# Altium schematic sheet Sheet1_TRP.SchDoc
size A4; SheetNumber: 1; SheetTotal: 1
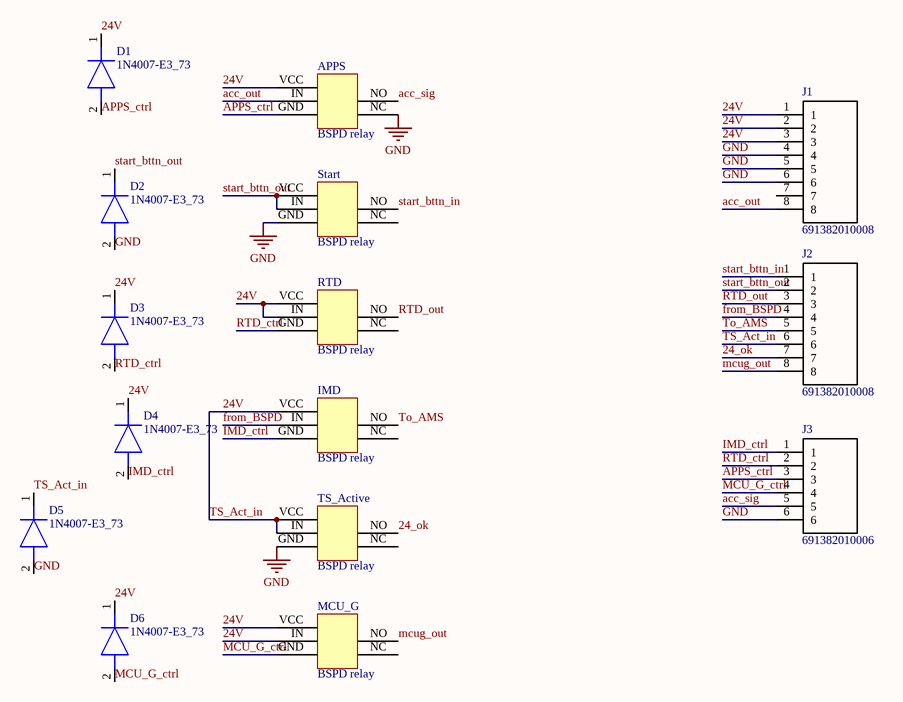
[diagram p0: Sheet1_TRP.SchDoc]

## Parts
APPS  BSPD relay  [relay]
D1  1N4007-E3_73  [DIOAD1405W86L465D235]
D2  1N4007-E3_73  [DIOAD1405W86L465D235]
D3  1N4007-E3_73  [DIOAD1405W86L465D235]
D4  1N4007-E3_73  [DIOAD1405W86L465D235]
D5  1N4007-E3_73  [DIOAD1405W86L465D235]
D6  1N4007-E3_73  [DIOAD1405W86L465D235]
IMD  BSPD relay  [relay]
J1  691382010008  [SHDRRA8W80P0X250_1X8_2200X1010X830P]
J2  691382010008  [SHDRRA8W80P0X250_1X8_2200X1010X830P]
J3  691382010006  [SHDRRA6W100P0X250_1X6_1700X1010X830P]
MCU_G  BSPD relay  [relay]
RTD  BSPD relay  [relay]
Start  BSPD relay  [relay]
TS_Active  BSPD relay  [relay]

## Nets
GND: APPS.NC D2.2(A) D5.2(A) J1.4 J1.5 J1.6 J3.6 Start.GND TS_Active.GND
24_ok: J2.7 TS_Active.NO
24V: APPS.VCC D1.1(K) D3.1(K) D4.1(K) D5.1(K) D6.1(K) IMD.VCC J1.1 J1.2 J1.3 J2.6 MCU_G.IN MCU_G.VCC RTD.IN RTD.VCC TS_Active.IN TS_Active.VCC  [also labelled TS_Act_in]
acc_out: APPS.IN J1.8
acc_sig: APPS.NO J3.5
APPS_ctrl: APPS.GND D1.2(A) J3.3
from_BSPD: IMD.IN J2.4
IMD_ctrl: D4.2(A) IMD.GND J3.1
MCU_G_ctrl: D6.2(A) J3.4 MCU_G.GND
mcug_out: J2.8 MCU_G.NO
RTD_ctrl: D3.2(A) J3.2 RTD.GND
RTD_out: J2.3 RTD.NO
start_bttn_in: J2.1 Start.NO
start_bttn_out: D2.1(K) J2.2 Start.IN Start.VCC
To_AMS: IMD.NO J2.5

Not connected (* = marked no-connect by the designer): IMD NC; J1 7; MCU_G NC; RTD NC; Start NC; TS_Active NC

## Library data of the parts
APPS IMD MCU_G RTD Start TS_Active = leone_relay
D1-D6 = 1N4007-E3_73: Diode; Manufacturer_Name: Vishay; Manufacturer_Part_Number: 1N4007-E3/73; Datasheet Link: https://mouser.componentsearchengine.com/Datasheets/2/1N4007-E3_73.pdf; Mouser Part Number: 625-1N4007-E3/73; Mouser Price/Stock: https://www.mouser.co.uk/ProductDetail/Vishay-General-Semiconductor/1N4007-E3-73?qs=N4vtoAxH%2FSqT3Ng3e4K0Gw%3D%3D; Arrow Part Number: 1N4007-E3/73; Arrow Price/Stock: https://www.arrow.com/en/products/1n4007-e373/vishay?region=europe
J1 J2 = 691382010008: Connector; Manufacturer_Name: Wurth Elektronik; Datasheet Link: https://katalog.we-online.de/em/datasheet/6913820100xx.pdf; Height: 8.3mm; Manufacturer_Part_Number: 691382010008; Mouser Part Number: 710-691382010008; Mouser Price/Stock: https://www.mouser.co.uk/ProductDetail/Wurth-Elektronik/691382010008?qs=a9WhcLg8qCws8OYIQRBfFA%3D%3D
J3 = 691382010006: Connector; Manufacturer_Name: Wurth Elektronik; Datasheet Link: https://katalog.we-online.de/em/datasheet/6913820100xx.pdf; Height: 8.3mm; Manufacturer_Part_Number: 691382010006; Mouser Part Number: 710-691382010006; Mouser Price/Stock: https://www.mouser.co.uk/ProductDetail/Wurth-Elektronik/691382010006?qs=a9WhcLg8qCzBFK%252BQrj%2FNUg%3D%3D